# EAGLE design Steering Wheel Raspberry Pi (EAGLE 8.4.0)
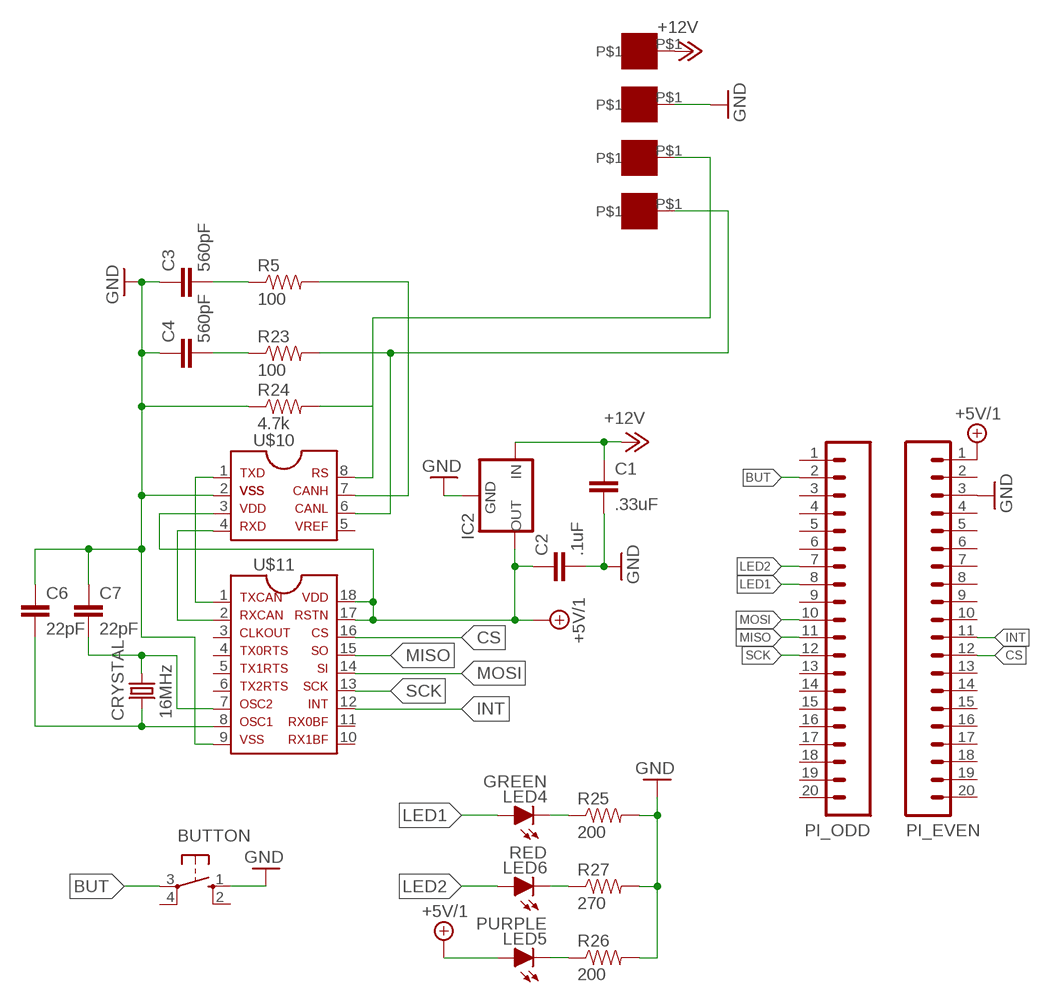
[diagram p0: schematic, sheet 1]

## Parts
BUTTON  BTN_10-XX  [B3F-10XX]
C1  .33uF  CAP0805  [0805]
C2  .1uF  CAP0805  [0805]
C3  560pF  CAP0805  [0805]
C4  560pF  CAP0805  [0805]
C6  22pF  CAP0805  [0805]
C7  22pF  CAP0805  [0805]
CRYSTAL  16MHz  CRYSTALSMD  [HC49UP]
IC2  OKI-78SR-5/1.5-W36-C_VERT  [TO-220]
LED4  GREEN  LED-0805  [LED-805]
LED5  PURPLE  LED-0805  [LED-805]
LED6  RED  LED-0805  [LED-805]
PI_EVEN  M20  [1X20]
PI_ODD  M20  [1X20]
R5  100  RESISTOR0805-RES  [0805]
R23  100  RESISTOR0805-RES  [0805]
R24  4.7k  RESISTOR0805-RES  [0805]
R25  200  RESISTOR0805-RES  [0805]
R26  200  RESISTOR0805-RES  [0805]
R27  270  RESISTOR0805-RES  [0805]
U$1  SOLDER_PAD  [SOLDER_PAD_XSMALL]
U$2  SOLDER_PAD  [SOLDER_PAD_XSMALL]
U$3  SOLDER_PAD  [SOLDER_PAD_XSMALL]
U$4  SOLDER_PAD  [SOLDER_PAD_XSMALL]
U$10  MCP2551  [SOIC-08]
U$11  MCP2515SMD  [SOIC-18W]

## Nets
+5V/1: C2.1 IC2.3(OUT) LED5.A PI_EVEN.1 U$10.3 U$11.17 U$11.18
+12V: C1.1 IC2.1(IN) U$1.P$1
BUT: BUTTON.3(P) PI_ODD.2
CAN-H: R5.2 U$10.7
CAN-L: R23.2 U$4.P$1 U$10.6
CS: PI_EVEN.12 U$11.16
GND: BUTTON.1(S) C1.2 C2.2 C3.1 C4.1 C6.1 C7.1 IC2.2(GND) PI_EVEN.3 R24.1 R25.2 R26.2 R27.2 U$2.P$1 U$10.2 U$11.9
INT: PI_EVEN.11 U$11.12
LED1: LED4.A PI_ODD.8
LED2: LED6.A PI_ODD.7
MISO: PI_ODD.11 U$11.15
MOSI: PI_ODD.10 U$11.14
N$37: U$10.1 U$11.1
N$39: U$10.4 U$11.2
N$40: C6.2 CRYSTAL.2 U$11.8
N$41: R24.2 U$3.P$1 U$10.8
N$42: C7.2 CRYSTAL.1 U$11.7
N$43: C3.2 R5.1
N$50: C4.2 R23.1
N$52: LED4.C R25.1
N$53: LED5.C R26.1
N$54: LED6.C R27.1
SCK: PI_ODD.12 U$11.13
Unconnected: BUTTON.2(S1) BUTTON.4(P1) PI_EVEN.2 PI_EVEN.4 PI_EVEN.5 PI_EVEN.6 PI_EVEN.7 PI_EVEN.8 PI_EVEN.9 PI_EVEN.10 PI_EVEN.13 PI_EVEN.14 PI_EVEN.15 PI_EVEN.16 PI_EVEN.17 PI_EVEN.18 PI_EVEN.19 PI_EVEN.20 PI_ODD.1 PI_ODD.3 PI_ODD.4 PI_ODD.5 PI_ODD.6 PI_ODD.9 PI_ODD.13 PI_ODD.14 PI_ODD.15 PI_ODD.16 PI_ODD.17 PI_ODD.18 PI_ODD.19 PI_ODD.20 U$10.5 U$11.3 U$11.4 U$11.5 U$11.6 U$11.10 U$11.11

## Library data of the parts
BUTTON = HyTechDevices:BTN_10-XX: Small momentary tactile push button; MPN: B3F-1000; OC_FARNELL: 176432; OC_NEWARK: 36M3542
C1-C4 C6 C7 = HyTechDevices:CAP: Capacitor Standard 0603 ceramic capacitor, and 0.1" leaded capacitor.
CRYSTAL = SparkFun-FreqCtrl:CRYSTAL: Various standard crystals. Proven footprints.
IC2 = HyTechDevices:OKI-78SR-5/1.5-W36-C: Voltage Regulator Switching 5v regulator Datasheet <http://power.murata.com/data/power/oki-78sr.pdf> Standard 7805 5V regulator. IGO (Input Ground Output). Spark Fun Electronics SKU : COM-00107 Datasheet <http://www.mouser.com/ds/2/308/MC7800-D-94905.pdf>
LED4-LED6 = HyTechDevices:LED: Light Emitting Diode (LED) Source: Dangerous Prototypes Eagle Library <https://github.com/DangerousPrototypes/Eagle_Part_Library>
PI_EVEN PI_ODD = HyTechDevices:M20: 1x20 .1" header This is just like the LOCK variant in that the holes are staggared by 5 mil, but except for the last two holes. They are not altered from the "standard" footprint layout. This is used for a special purpose on the layout of our Graphic LCD Backpack. Make sure you want to use this device before selecting it for you project! Source: Sparkfun <https://github.com/sparkfun/SparkFun-Eagle-Libraries>
R5 R23-R27 = HyTechDevices:RESISTOR: Resistor Basic schematic elements and footprints for 0603, 1206, and PTH resistors.
U$1-U$4 = HyTechDevices:SOLDER_PAD: Solder pad used to attach wires directly to PCB
U$10 = HyTechDevices:MCP2551: MCP2551 High-Speed CAN Transceiver Product Webpage <https://www.microchip.com/wwwproducts/en/MCP2551> Datasheet <http://ww1.microchip.com/downloads/en/DeviceDoc/21667f.pdf> This device is outdated It is replaced by MCP2561. Comparison Page <https://www.microchip.com/wwwproducts/ProductCompare/MCP2551/MCP2561> Product Webpage <https://www.microchip.com/wwwproducts/en/MCP2561> Datasheet <http://ww1.microchip.com/downloads/en/DeviceDoc/20005167C.pdf>
U$11 = HyTechDevices:MCP2515: MCP2515 CAN Controller with SPI Interface Datasheet <http://ww1.microchip.com/downloads/en/DeviceDoc/21801G.pdf>

## Board
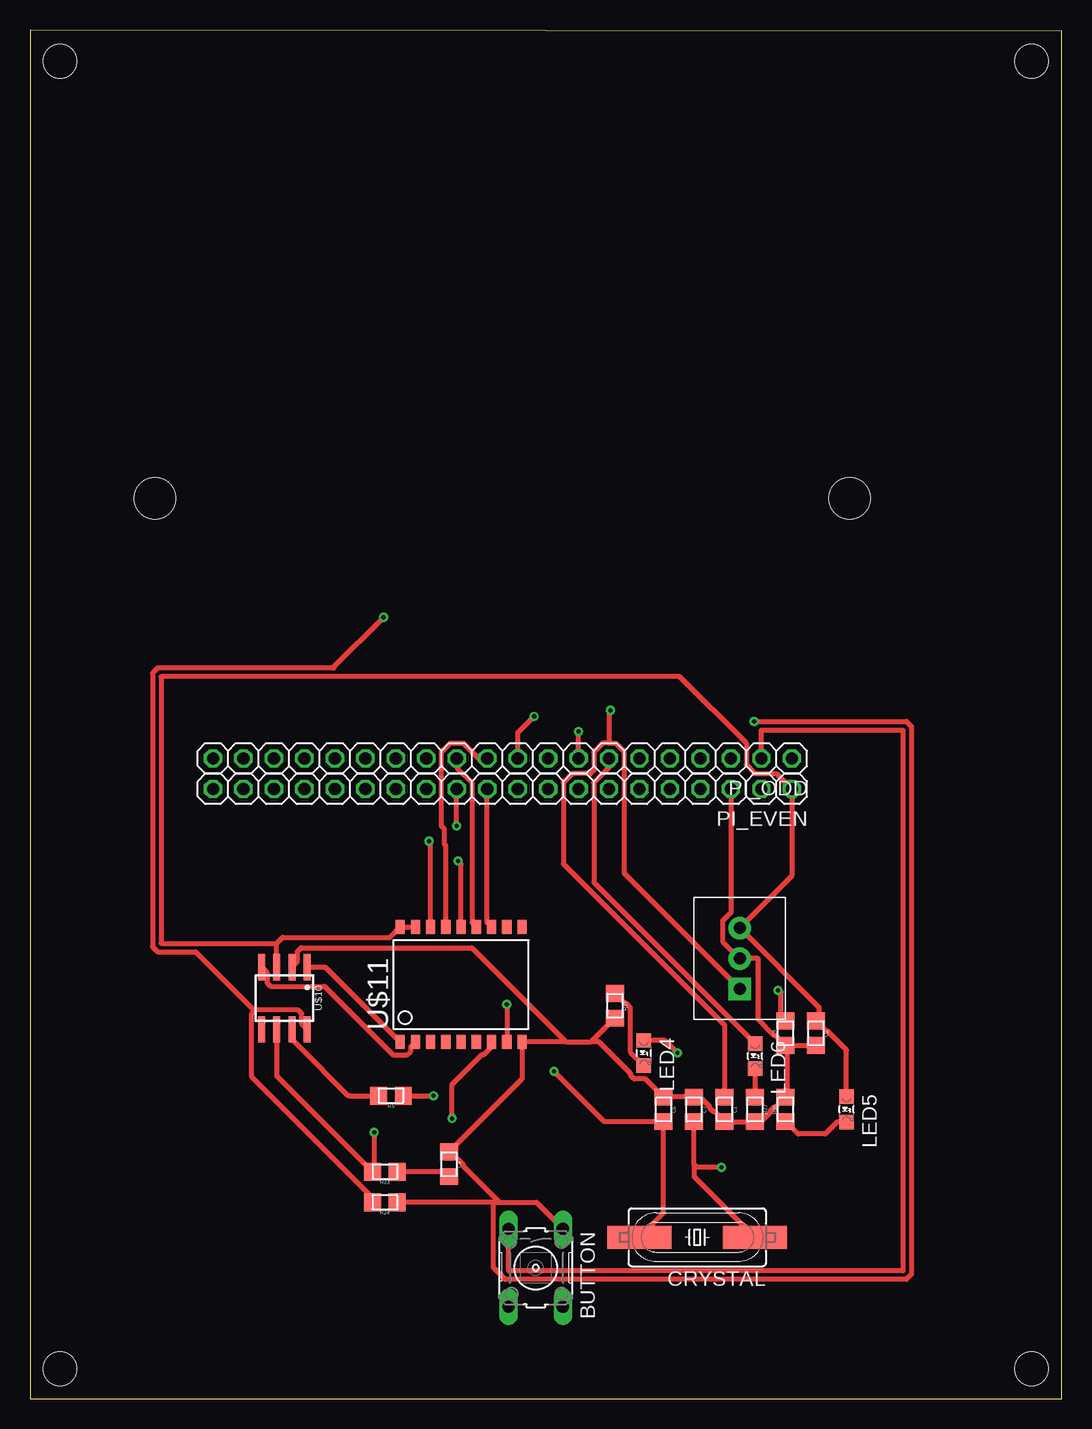
[diagram p1: board, top side]
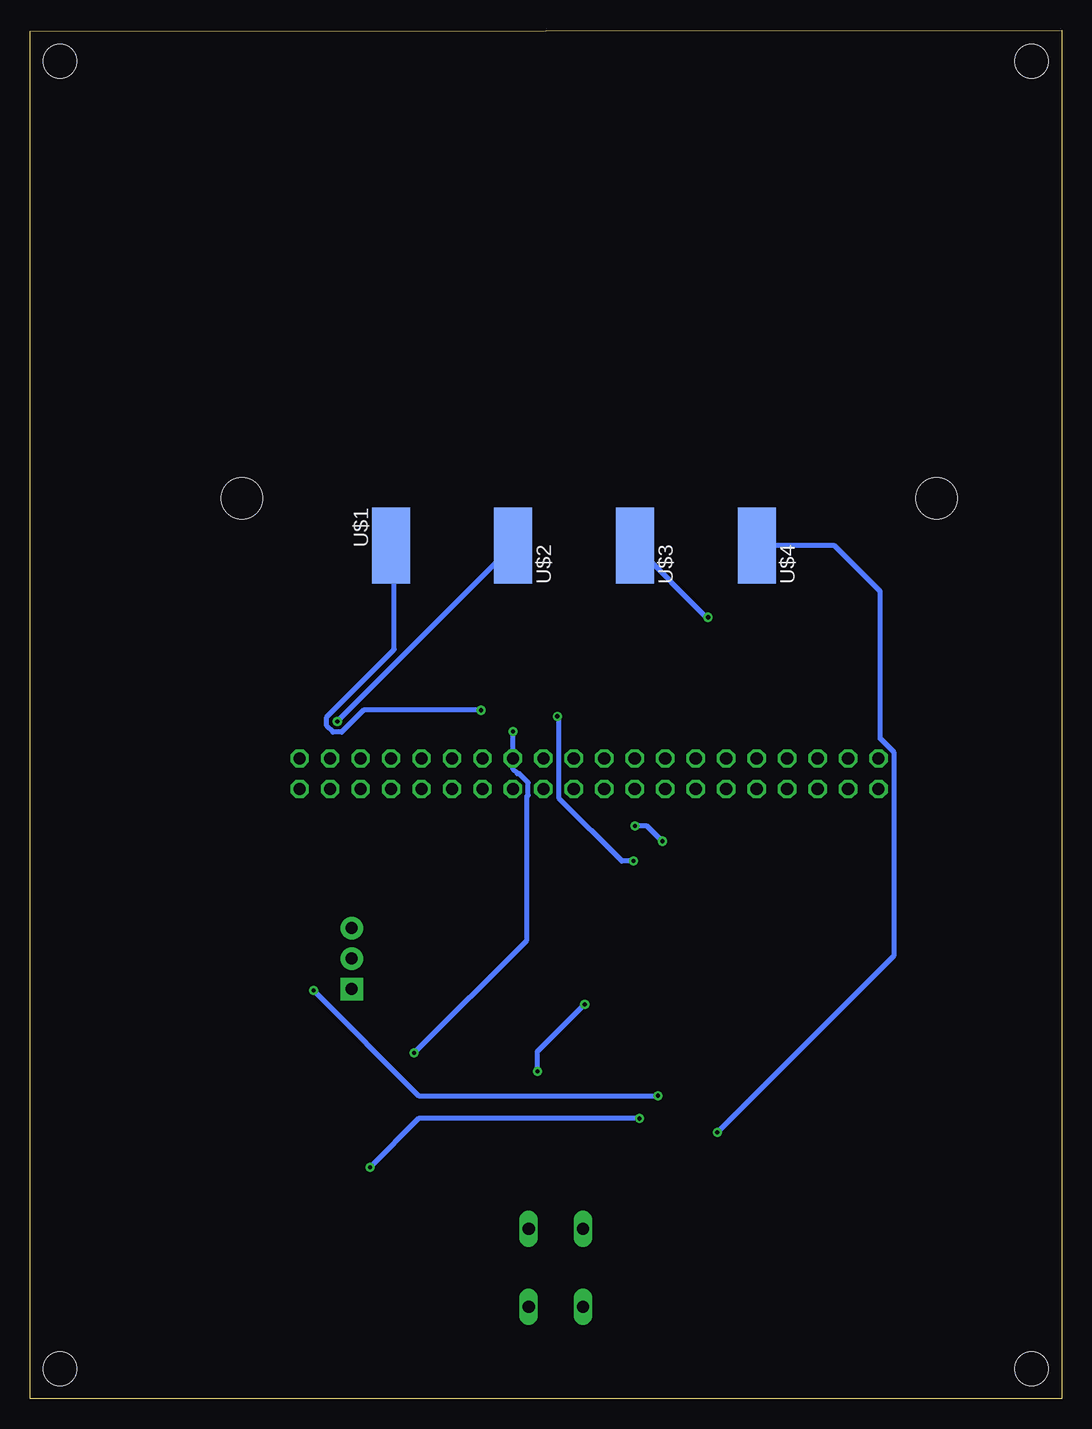
[diagram p2: board, bottom side, seen from below]

Size 86 x 114.11 mm. Coordinates in mm from the lower left corner, seen from the top.
Outline: 0,0 86,0 86,114 0,114.11 0,0
Copper layers (1*16): Top 0.035mm / dielectric 1.5mm / Bottom 0.035mm
Design rules "hytech": minimum track width 6mil, minimum drill 0.35mm, track to track 12mil, track to pad 12mil, pad to pad 12mil, via to via 12mil, smd to smd 12mil, copper to edge 40mil, drill to drill 6mil, minimum pad ring 10mil, minimum via ring 8mil, stop-mask expansion 4mil, vias tented up to drill 0mil, thermal gap 10mil
Holes 2.8 mm at 2.5,2.5 83.5,2.5 2.5,111.5 83.5,111.5
Holes 3.43 mm at 68.33,75.06 10.41,75.06

### Footprints (pad centres in the part's own frame; a part is rotated, then mirrored left to right if it is on the bottom)
B3F-10XX = drill 1.016 long: 1 -3.251,2.261; 2 3.251,2.261; 3 -3.251,-2.261; 4 3.251,-2.261
0805 = smd 1.4 x 1.5: 1 -1.025,0; 2 1.025,0
HC49UP = smd 5.334 x 1.93: 1 -4.826,0; 2 4.826,0
TO-220 = drill 1 pad 1.88 square: 1 -2.54,0 | drill 1 pad 1.88: 2 0,0; 3 2.54,0
LED-805 = smd 1.2 x 1.2: A 0,-1.05; C 0,1.05
1X20 = drill 1.016 octagon: 1 0,0; 2 2.54,0; 3 5.08,0; 4 7.62,0; 5 10.16,0; 6 12.7,0; 7 15.24,0; 8 17.78,0; 9 20.32,0; 10 22.86,0; 11 25.4,0; 12 27.94,0; 13 30.48,0; 14 33.02,0; 15 35.56,0; 16 38.1,0; 17 40.64,0; 18 43.18,0; 19 45.72,0; 20 48.26,0
SOLDER_PAD_XSMALL = smd 6.35 x 3.175: P$1 0,0
SOIC-08 = smd 0.6 x 2.2: 1 -1.905,-2.6; 2 -0.635,-2.6; 3 0.635,-2.6; 4 1.905,-2.6; 5 1.905,2.6; 6 0.635,2.6; 7 -0.635,2.6; 8 -1.905,2.6
SOIC-18W = smd 0.762 x 1.143: 1 -5.08,-4.788; 2 -3.81,-4.788; 3 -2.54,-4.788; 4 -1.27,-4.788; 5 0,-4.788; 6 1.27,-4.788; 7 2.54,-4.788; 8 3.81,-4.788; 9 5.08,-4.788; 10 5.08,4.788; 11 3.81,4.788; 12 2.54,4.788; 13 1.27,4.788; 14 0,4.788; 15 -1.27,4.788; 16 -2.54,4.788; 17 -3.81,4.788; 18 -5.08,4.788

### Placement (x,y rotation side)
BUTTON  42.16,10.92 270 top
C1  57.91,24.13 270 top
C2  65.53,30.48 270 top
C3  62.99,30.48 90 top
C4  34.92,19.56 270 top
C6  52.83,24.13 270 top
C7  55.37,24.13 270 top
CRYSTAL  55.63,13.46 180 top
IC2  59.18,36.7 90 top
LED4  51.18,28.83 180 top
LED5  68.07,24.13 180 top
LED6  60.45,28.57 180 top
PI_EVEN  63.52,50.84 180 top
PI_ODD  63.52,53.39 180 top
R5  30.1,25.27 180 top
R23  29.59,18.92 180 top
R24  29.59,16.38 180 top
R25  48.77,32.77 270 top
R26  62.99,24.13 90 top
R27  60.45,24.13 270 top
U$1  55.88,71.12 270 bottom
U$2  45.72,71.12 90 bottom
U$3  35.56,71.12 90 bottom
U$4  25.4,71.12 90 bottom
U$10  21.21,33.4 180 top
U$11  35.94,34.54 0 top

### Tracks (layer width: path | path; a pad name or v marks a point on that pad's centre or on a via)
+5V/1
  Top 0.406: C2.1 65.53,31.48 65.78,31.23 | 65.78,31.23 65.78,32.65 IC2.3 63.52,43.58 PI_EVEN.1 62.24,52.12 60.45,52.12 59.71,52.86 59.71,54.65 54.16,60.2 10.92,60.2 10.92,37.97 20.57,37.97 | U$11.17 U$11.18 30.01,38.48 21.08,38.48 20.57,37.97 | U$10.3 20.57,37.97 | 65.78,31.23 66.35,30.66 66.49,30.66 68.07,29.08 LED5.A
+12V  (via drill 0.35)
  Top 0.406: 48.26,54.66 48.8,54.66 49.55,53.91 49.55,43.8 IC2.1 | 48.26,54.66 47.75,54.66 47.01,53.91 47.01,52.37 46.75,52.11 45.21,52.11 44.47,51.37 44.47,44.6 57.91,31.16 C1.1 | v48.39,57.4 48.26,57.28 48.26,54.66
  Bottom 0.406: U$1.P$1 55.63,70.87 55.63,62.47 61.26,56.83 61.26,56.1 60.74,55.58 60.01,55.58 58.18,57.4 v48.39,57.4
BUT
  Top 0.406: PI_ODD.2 60.98,55.75 72.77,55.75 72.77,10.67 39.9,10.67 BUTTON.3
CAN-H
  Top 0.406: 26.67,25.27 26.54,25.27 | 26.67,25.27 R5.2 | U$10.7 21.84,29.97 22.31,29.51 22.31,29.49 26.52,25.27 26.54,25.27 | 26.54,25.27 26.67,25.27
CAN-L  (via drill 0.35)
  Top 0.406: U$10.6 20.57,26.91 R23.2 28.7,19.06 v28.7,22.23
  Bottom 0.406: U$4.P$1 18.92,71.12 15.11,67.31 15.11,55.04 13.99,53.91 13.99,36.94 v28.7,22.23
CS  (via drill 0.35)
  Top 0.406: U$11.16 33.4,46.35 v33.27,46.48 | v35.56,47.75 35.58,47.77 PI_EVEN.12
  Bottom 0.406: v33.27,46.48 34.54,47.75 v35.56,47.75
GND  (via drill 0.35)
  Top 0.305: 63.12,29.45 C3.1
  Top 0.406: 63.12,29.21 63.12,25.28 R26.2 62.15,24.31 62.03,24.31 61.73,24.02 61.73,23.9 60.94,23.11 R27.2 C1.2 57.07,23.95 56.95,23.95 56.65,24.25 56.65,24.36 55.86,25.16 C7.1 C6.1 51.32,26.67 50.37,26.67 50.07,26.97 50.07,27.11 47.43,29.76 46.78,29.76 | 63.12,29.21 63.12,29.45 | C2.2 63.36,29.45 63.12,29.21 | IC2.2 59.18,36.62 | 44.7,29.76 U$11.9 41.02,26.68 34.98,20.64 | 44.7,29.76 46.78,29.76 | R25.2 46.78,29.76 | 34.98,20.64 C4.1 | 38.61,16.38 R24.1 | 38.61,16.38 39.12,16.38 | U$10.2 22.31,36.46 22.31,37.31 22.6,37.61 36.85,37.61 44.7,29.76 | PI_EVEN.3 58.44,40.55 57.73,39.84 57.73,38.15 IC2.2 | IC2.2 60.72,36.7 60.72,31.61 62.03,30.3 62.15,30.3 C3.1 | 39.12,16.38 36.18,19.32 36.18,19.44 35.88,19.74 | 35.88,19.74 | 35.88,19.74 34.98,20.64 | v60.38,56.46 73.07,56.46 73.48,56.05 73.48,10.37 73.07,9.96 39.61,9.96 38.63,10.93 38.63,16.36 38.61,16.38 | 39.12,16.38 42.22,16.38 BUTTON.1
  Bottom 0.406: U$2.P$1 v60.38,56.46
INT
  Top 0.406: U$11.12 38.12,39.69 PI_EVEN.11
LED1  (via drill 0.35)
  Top 0.406: PI_ODD.8 45.74,55.61 v45.72,55.63 | v53.98,28.83 52.92,29.88 LED4.A
  Bottom 0.406: v45.72,55.63 45.72,52.48 45.36,52.11 45.21,52.11 44.47,51.37 44.47,50.32 44.57,50.21 44.57,38.23 v53.98,28.83
LED2
  Top 0.406: PI_ODD.7 48.28,52.64 47.01,51.37 47.01,43.07 LED6.A
MISO
  Top 0.406: U$11.15 34.67,46.1 34.54,46.23 34.54,47.52 34.31,47.75 34.31,53.91 35.05,54.66 36.1,54.66 37.38,53.39 PI_ODD.11
MOSI  (via drill 0.35)
  Top 0.406: U$11.14 35.94,44.58 v35.69,44.83 | v42.04,56.9 40.66,55.52 PI_ODD.10
  Bottom 0.406: v35.69,44.83 36.66,44.83 41.93,50.1 41.93,56.9 v42.04,56.9
N$37
  Top 0.406: U$10.1 24.62,36 U$11.1
N$39
  Top 0.406: U$10.4 19.77,35.54 19.77,34.69 20.06,34.39 24.55,34.39 30.27,28.68 31.45,28.68 31.75,28.97 31.75,29.38 U$11.2
N$40  (via drill 0.35)
  Top 0.406: CRYSTAL.2 52.83,15.49 C6.2 47.89,23.11 v43.69,27.3 | v39.75,32.89 U$11.8
  Bottom 0.406: v43.69,27.3 43.69,28.96 v39.75,32.89
N$41  (via drill 0.35)
  Top 0.406: 18.72,32.34 18.5,32.11 18.5,26.82 28.57,16.75 R24.2 | 18.72,32.34 18.79,32.41 22.35,32.41 22.65,32.11 22.65,31.26 U$10.8 | 25.27,60.91 25.35,60.91 | 25.27,60.91 10.63,60.91 10.21,60.49 10.21,37.68 10.63,37.26 13.79,37.26 18.72,32.34 | v29.46,65.15 25.27,60.96 25.27,60.91
  Bottom 0.406: U$3.P$1 29.59,65.15 v29.46,65.15
N$42  (via drill 0.35)
  Top 0.406: 55.37,19.56 C7.2 | 55.37,19.56 55.37,18.54 CRYSTAL.1 | v35.18,23.37 35.18,26.2 37.66,28.68 37.8,28.68 38.48,29.36 U$11.7 | v57.66,19.3 55.63,19.3 55.37,19.56
  Bottom 0.406: v35.18,23.37 53.59,23.37 v57.66,19.3
N$43  (via drill 0.35)
  Top 0.406: C3.2 62.61,31.89 62.61,33.91 62.48,34.04 v62.36,34.04 | R5.1 v33.66,25.27
  Bottom 0.406: v62.36,34.04 53.59,25.27 v33.66,25.27
N$50
  Top 0.406: C4.2 34.53,18.92 R23.1
N$52
  Top 0.406: R25.1 49.61,32.95 49.73,32.95 50.03,32.65 50.03,28.93 LED4.C
N$53
  Top 0.406: LED5.C 67.31,23.08 66.3,22.07 64.02,22.07 R26.1
N$54
  Top 0.406: LED6.C R27.1
SCK
  Top 0.406: PI_ODD.12 35.58,52.64 36.85,51.37 36.85,39.69 U$11.13